# Altium project cheese_cave.PrjPcb
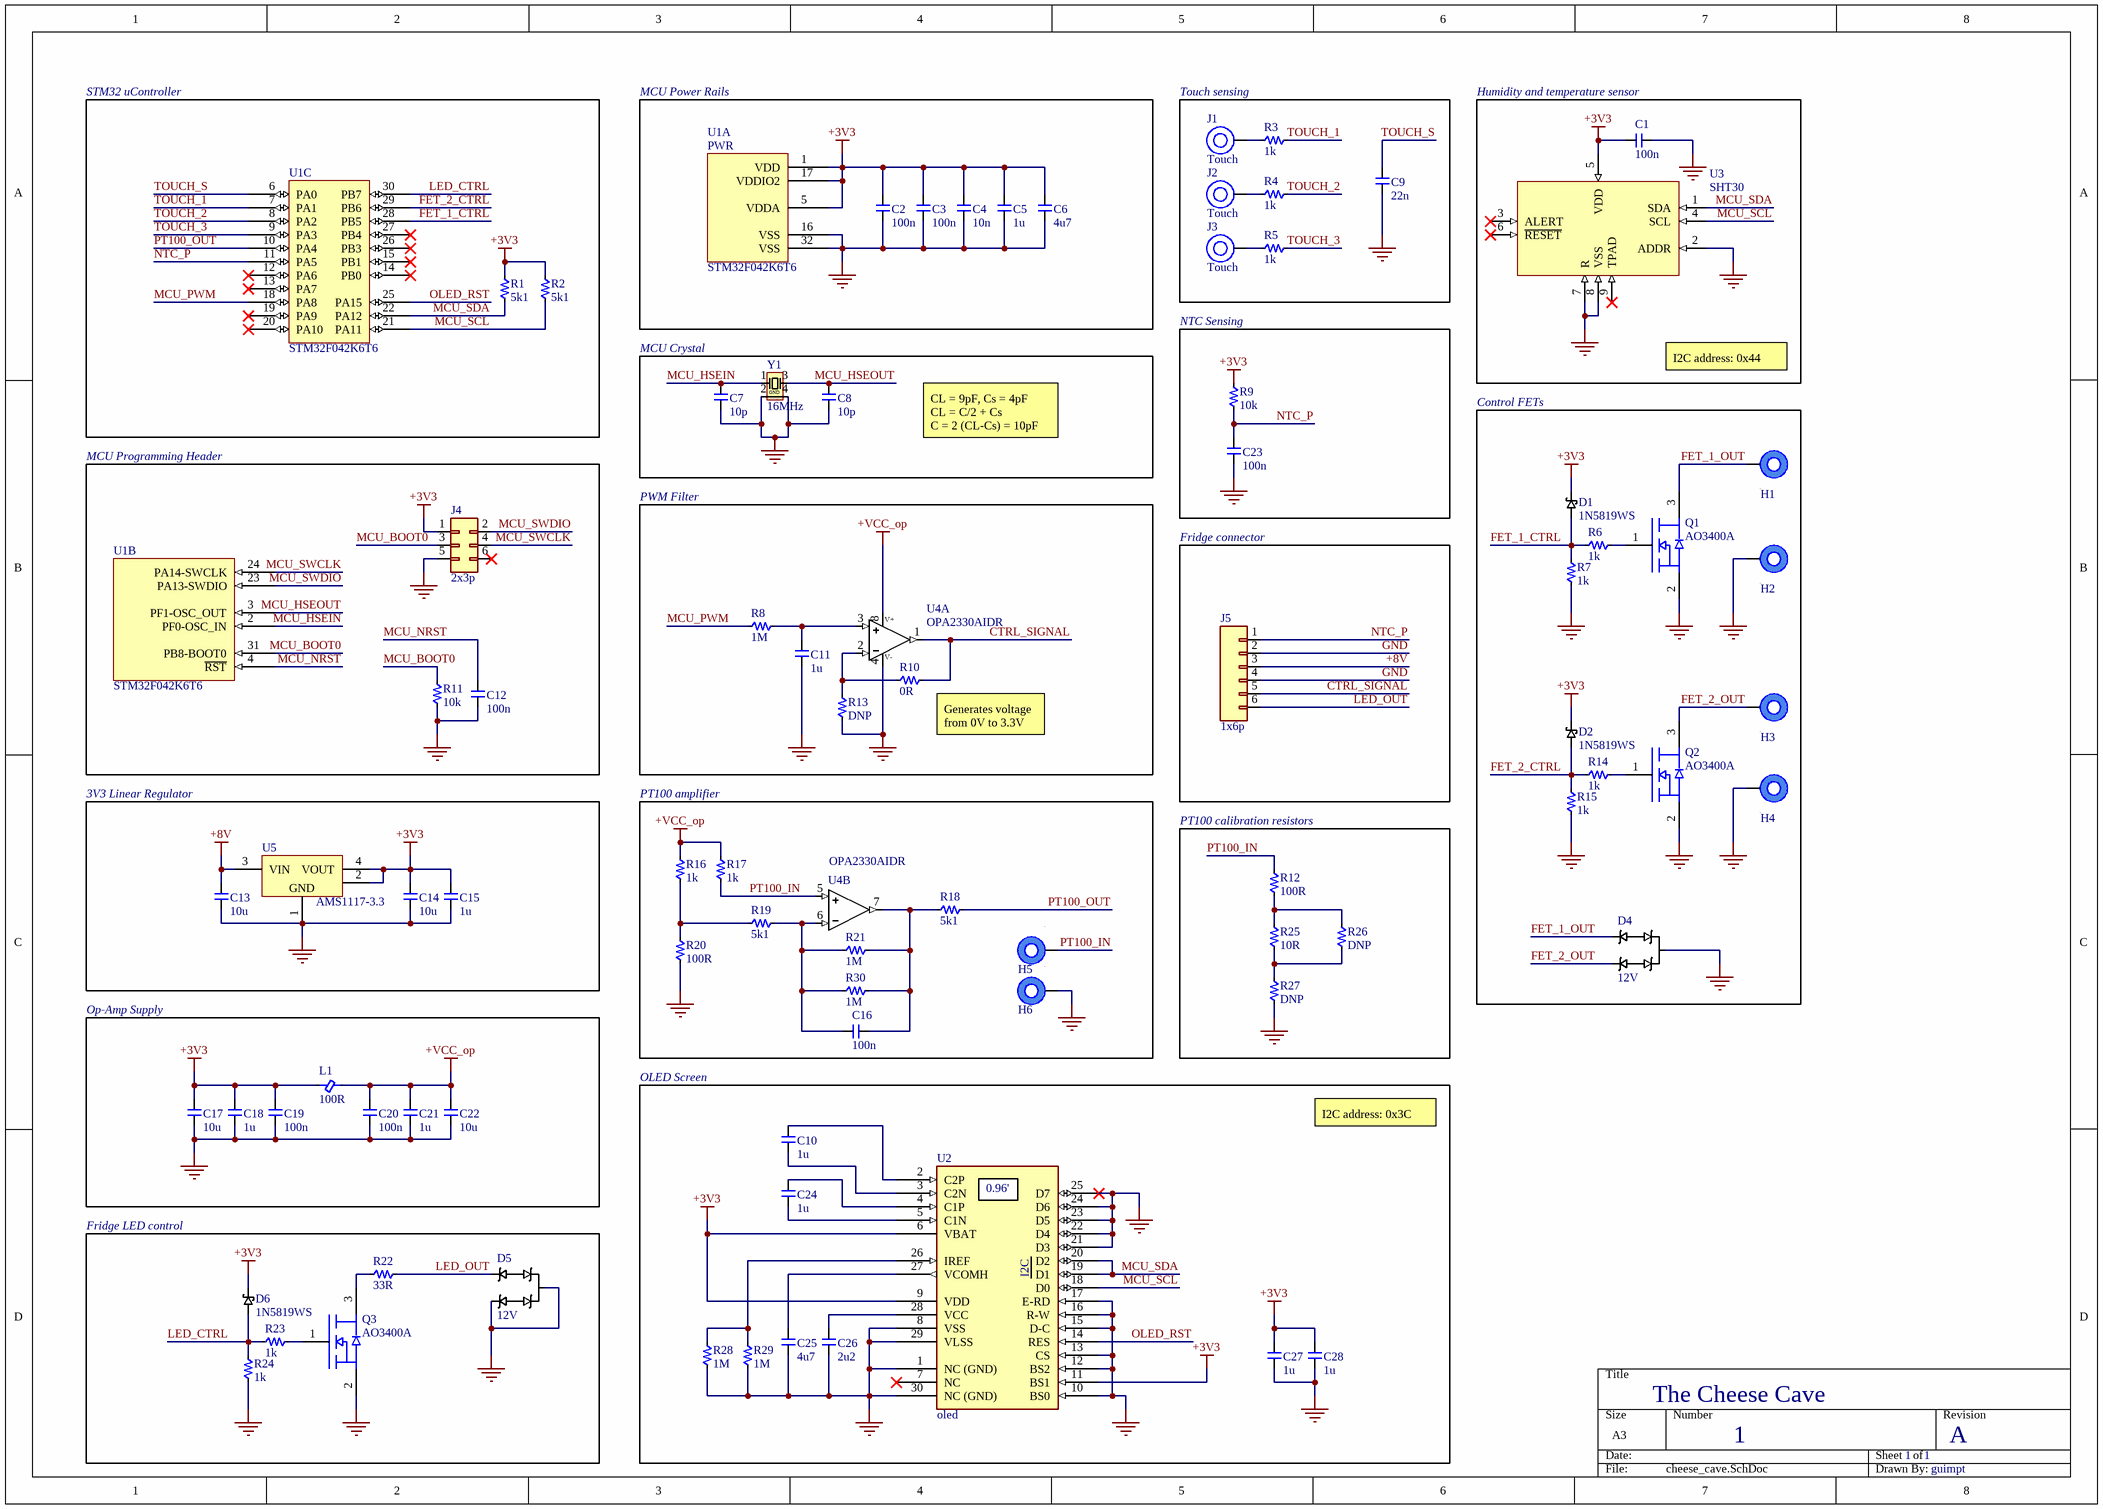
[diagram p0: cheese_cave.SchDoc]
1 sheet, 84 parts. Net scope: global (net labels, ports and power ports of the same name join across sheets).
Board file: cheese_cave.PcbDoc

## Sheet cheese_cave.SchDoc
size A3; SheetNumber: 1; SheetTotal: 1

### Parts
C1  100n  [C0402]
C2  100n  [C0402]
C3  100n  [C0402]
C4  10n  [C0402]
C5  1u  [C0805]
C6  4u7  [C0805]
C7  10p  [C0402]
C8  10p  [C0402]
C9  22n  [C0402]
C10  1u  [C0805]
C11  1u  [C0805]
C12  100n  [C0402]
C13  10u  [C0805]
C14  10u  [C0805]
C15  1u  [C0805]
C16  100n  [C0402]
C17  10u  [C0805]
C18  1u  [C0805]
C19  100n  [C0402]
C20  100n  [C0402]
C21  1u  [C0805]
C22  10u  [C0805]
C23  100n  [C0402]
C24  1u  [C0805]
C25  4u7  [C0805]
C26  2u2  [C0805]
C27  1u  [C0805]
C28  1u  [C0805]
D1  1N5819WS  [SOD323]
D2  1N5819WS  [SOD323]
D4  12V  [SOT23_protek]
D5  12V  [SOT23_protek]
D6  1N5819WS  [SOD323]
H1  1x1  [1x1p]  (value not drawn)  (no BOM)
H2  1x1  [1x1p]  (value not drawn)  (no BOM)
H3  1x1  [1x1p]  (value not drawn)  (no BOM)
H4  1x1  [1x1p]  (value not drawn)  (no BOM)
H5  1x1  [1x1p]  (value not drawn)  (no BOM)
H6  1x1  [1x1p]  (value not drawn)  (no BOM)
J1  Touch  [F10-10-6.5-0.4 Z]  (no BOM)
J2  Touch  [F10-10-6.5-0.4 Z]  (no BOM)
J3  Touch  [F10-10-6.5-0.4 Z]  (no BOM)
J4  2x3p  [2x3p_conn]
J5  1x6p  [1X6P_CONN]
L1  100R  [L0805]
Q1  AO3400A  [SOT23_alphaomega]
Q2  AO3400A  [SOT23_alphaomega]
Q3  AO3400A  [SOT23_alphaomega]
R1  5k1  [R0402]
R2  5k1  [R0402]
R3  1k  [R0402]
R4  1k  [R0402]
R5  1k  [R0402]
R6  1k  [R0402]
R7  1k  [R0402]
R8  1M  [R0402]
R9  10k  [R0402]
R10  0R  [R0402]
R11  10k  [R0402]
R12  100R  [R0402]
R13  DNP  [R0402]
R14  1k  [R0402]
R15  1k  [R0402]
R16  1k  [R0402]
R17  1k  [R0402]
R18  5k1  [R0402]
R19  5k1  [R0402]
R20  100R  [R0402]
R21  1M  [R0402]
R22  33R  [R0402]
R23  1k  [R0402]
R24  1k  [R0402]
R25  10R  [R0402]
R26  DNP  [R0402]
R27  DNP  [R0402]
R28  1M  [R0402]
R29  1M  [R0402]
R30  1M  [R0402]
U1  STM32F042K6T6  [LQFP32-ST]  (parts A,B,C of 3)
U2  oled  [OLED_096_SSD1306]
U3  SHT30  [SHT30-DIS-B2.5KS]
U4  OPA2330AIDR  [SOIC8]  (parts A,B of 2)
U5  AMS1117-3.3  [SOT223]
Y1  16MHz  [SMD3225-4P]

### Blocks framed on the sheet
STM32 uController: R1 R2 U1
MCU Power Rails: C2-C6 U1
Touch sensing: C9 J1-J3 R3-R5
Humidity and temperature sensor: C1 U3
NTC Sensing: C23 R9
MCU Crystal: C7 C8 Y1
Control FETs: D1 D2 D4 H1-H4 Q1 Q2 R6 R7 R14 R15
MCU Programming Header: C12 J4 R11 U1
PWM Filter: C11 R8 R10 R13 U4
Fridge connector: J5
3V3 Linear Regulator: C13-C15 U5
PT100 amplifier: C16 H5 H6 R16-R21 R30 U4
PT100 calibration resistors: R12 R25-R27
Op-Amp Supply: C17-C22 L1
OLED Screen: C10 C24-C28 R28 R29 U2
Fridge LED control: D5 D6 Q3 R22-R24

### Nets
+3V3: C1.1 C2.2 C3.2 C4.2 C5.2 C6.2 C14.2 C15.2 C17.2 C18.2 C19.2 C27.1 C28.1 D1.2 D2.2 D6.2 J4.1 L1.1 R1.1 R2.1 R9.2 U1.1(VDD) U1.5(VDDA) U1.17(VDDIO2) U2.6(VBAT) U2.9(VDD) U2.11(BS1) U3.5(VDD) U5.2(VOUT) U5.4(VOUT)
+8V: C13.2 J5.3 U5.3(VIN)
+VCC_op: C20.2 C21.2 C22.2 L1.2 R16.2 R17.2 U4.8(V+)
GND: C1.2 C2.1 C3.1 C4.1 C5.1 C6.1 C7.1 C8.1 C9.1 C11.1 C12.1 C13.1 C14.1 C15.1 C17.1 C18.1 C19.1 C20.1 C21.1 C22.1 C23.1 C25.2 C26.2 C27.2 C28.2 D4.3 D5.2 D5.3 H2.1 H4.1 H6.1 J4.5 J5.2 J5.4 Q1.2 Q2.2 Q3.2 R7.1 R11.1 R13.1 R15.1 R20.1 R24.1 R27.1 R28.1 R29.1 U1.16(VSS) U1.32(VSS) U2.1(NC_(GND)) U2.8(VSS) U2.10(BS0) U2.12(BS2) U2.13(CS) U2.15(D-C) U2.16(R-W) U2.17(E-RD) U2.21(D3) U2.22(D4) U2.23(D5) U2.24(D6) U2.25(D7) U2.29(VLSS) U2.30(NC_(GND)) U3.2(ADDR) U3.7(R) U3.8(VSS) U4.4(V-) U5.1(GND) Y1.2 Y1.4
CTRL_SIGNAL: J5.5 R10.2 U4.1(outA)
FET_1_CTRL: D1.1 R6.2 R7.2 U1.28(PB5)
FET_1_OUT: D4.1 H1.1 Q1.3
FET_2_CTRL: D2.1 R14.2 R15.2 U1.29(PB6)
FET_2_OUT: D4.2 H3.1 Q2.3
LED_CTRL: D6.1 R23.2 R24.2 U1.30(PB7)
LED_OUT: D5.1 J5.6 R22.2
MCU_BOOT0: J4.3 R11.2 U1.31(PB8-BOOT0)
MCU_HSEIN: C7.2 U1.2(PF0-OSC_IN) Y1.1
MCU_HSEOUT: C8.2 U1.3(PF1-OSC_OUT) Y1.3
MCU_NRST: C12.2 U1.4(~{RST})
MCU_PWM: R8.2 U1.18(PA8)
MCU_SCL: R2.2 U1.21(PA11) U2.18(D0) U3.4(SCL)
MCU_SDA: R1.2 U1.22(PA12) U2.19(D1) U2.20(D2) U3.1(SDA)
MCU_SWCLK: J4.4 U1.24(PA14-SWCLK)
MCU_SWDIO: J4.2 U1.23(PA13-SWDIO)
NTC_P: C23.2 J5.1 R9.1 U1.11(PA5)
OLED_RST: U1.25(PA15) U2.14(RES)
PT100_IN: H5.1 R12.2 R17.1 U4.5(INB+)
PT100_OUT: R18.2 U1.10(PA4)
TOUCH_1: R3.1 U1.7(PA1)
TOUCH_2: R4.1 U1.8(PA2)
TOUCH_3: R5.1 U1.9(PA3)
TOUCH_S: C9.2 U1.6(PA0)
NetC10_1: C10.1 U2.3(C2N)
NetC10_2: C10.2 U2.2(C2P)
NetC11_2: C11.2 R8.1 U4.3(INA+)
NetC16_1: C16.1 R18.1 R21.2 R30.2 U4.7(outB)
NetC16_2: C16.2 R19.2 R21.1 R30.1 U4.6(INB-)
NetC24_1: C24.1 U2.4(C1P)
NetC24_2: C24.2 U2.5(C1N)
NetC25_1: C25.1 U2.27(VCOMH)
NetC26_1: C26.1 U2.28(VCC)
NetJ1_1: J1.1 R3.2
NetJ2_1: J2.1 R4.2
NetJ3_1: J3.1 R5.2
NetQ1_1: Q1.1 R6.1
NetQ2_1: Q2.1 R14.1
NetQ3_1: Q3.1 R23.1
NetQ3_3: Q3.3 R22.1
NetR10_1: R10.1 R13.2 U4.2(INA-)
NetR12_1: R12.1 R25.2 R26.2
NetR16_1: R16.1 R19.1 R20.2
NetR25_1: R25.1 R26.1 R27.2
NetR28_2: R28.2 R29.2 U2.26(IREF)

Not connected (* = marked no-connect by the designer): J4 6*; U1 12(PA6)* 13(PA7)* 14(PB0)* 15(PB1)* 19(PA9)* 20(PA10)* 26(PB3)* 27(PB4)*; U2 7(NC)*; U3 3(ALERT)* 6(~{RESET})* 9(TPAD)*

### Notes on the sheet
- I2C address: 0x44
- CL = 9pF, Cs = 4pF
  CL = C/2 + Cs
  C = 2 (CL-Cs) = 10pF
- (near R10) Generates voltage from 0V to 3.3V
- I2C address: 0x3C
- The Cheese Cave
- 1
- A
- guimpt
- (in symbol OLED_096_SSD1306) 0.96'; I2C
- (in symbol STM32F042K6T6, part A) PWR
- (in symbol X322516MLB4SI) GND

### Library data of the parts
C1-C4 C7-C9 C12 C16 C19 C20 C23 = C_0402: 0402 cap
  C1-C3 C12 C16 C19 C20 C23: LCSC: C1525
  C4: LCSC: C15195
  C7 C8: LCSC: C32949
  C9: LCSC: C1532
C5 C6 C10 C11 C13-C15 C17 C18 C21 C22 C24-C28 = C_0805: 0805 cap
  C5 C10 C11 C15 C18 C21 C24 C27 C28: LCSC: C28323
  C6 C25: LCSC: C1779
  C13 C14 C17 C22: LCSC: C15850
  C26: LCSC: C377773
D1 D2 D6 = 1N5819WS: 40V 600mV@1A 1A SOD-323  Schottky; LCSC: C191023
D4 D5 = PSM712-LF-T7: 19V 13.3V 12V SOT-23(TO-236)  TVS; LCSC: C32677
H1-H6 = 1x1p: 0.85mm hole
J1-J3 = F10-10-6.5-0.4Z
J4 = 2x3p_conn: 2x3 male pin header; LCSC: C124390
J5 = 1x6p_conn: 1x6 male pin header; LCSC: C7501293
L1 = GZ2012D101TF: ±25% 100Ω@100MHz 0805  150mR Ferrite Beads; LCSC: C1015
Q1-Q3 = AO3400A: 30V 5.7A 26.5mΩ@10V,5.7A 1.4W N Channel SOT-23-3L  MOSFET; LCSC: C20917
R1-R30 = R_0402: 0402 62.5mW
  R1 R2 R18 R19: LCSC: C25905
  R3-R7 R14-R17 R23 R24: LCSC: C11702
  R8 R21 R28-R30: LCSC: C26083
  R9 R11: LCSC: C25744
  R10: LCSC: C17168
  R12 R20: LCSC: C25076
  R22: LCSC: C25105
  R25: LCSC: C25077
U1 = STM32F042K6T6: RISC Microcontroller, 32-Bit, FLASH, CORTEX-M0 CPU, 48MHz, CMOS, PQFP32; Manufacturer: STMicroelectronics; Package Body Material: Plastic; Clock Frequency: 32MHz; Number of I/O Lines: 26; Speed: 48RPM; Max Supply Voltage: 3.6V; Min Supply Voltage: 2V; Nominal Supply Voltage: 3.3V; Package Equivalence Code: QFP32,.35SQ,32; Power Supplies: 2.5/3.3V; Max Supply Current: 23.4mA; Qualification Status: Not Qualified; Supplier: Mouser; Supplier Part Number: 511-STM32F042K6T6; Manufacturer Part Number: STM32F042K6T6; RoHS: Yes; Category: Microcontrollers; Stock: 3030; Pricing: 1=3.82, 10=3.43, 50=3.43, 100=2.81, 1000=2.02, 10000=1.98 (USD); Case/Package: LQFP; Pins: 32; Package Shape: Square; Min Operating Temperature: -40°C; Max Operating Temperature: 85°C; JESD-30 Code: S-PQFP-G32; Package Style: FLATPACK, LOW PROFILEMeter; Surface Mount: Yes; Technology: CMOS; Terminal Form: Gull Wing; Terminal Position: QUAD; Length: 7mm; Width: 7mm; Height - Seated (Max): 1.6mm; Terminal Pitch: 0.8mm; Temperature Grade: INDUSTRIAL; Reach SVHC Compliant: Yes; RoHS Compliant: Yes; ComponentLink1URL: https://datasheet.ciiva.com:443/pdfs/VipMasterIC/IC/SGST/SGST-S-A0002862944/SGST-S-A0002862944-1.pdf?src-supplier=IHS+Markit; ComponentLink1Description: https://datasheet.ciiva.com:443/pdfs/VipMasterIC/IC/SGST/SGST-S-A0002862944/SGST-S-A0002862944-1.pdf?src-supplier=IHS+Markit; ComponentLink2URL: https://datasheet.ciiva.com/48492/dm00105814-48492533.pdf?src-supplier=Avnet; ComponentLink2Description: https://datasheet.ciiva.com/48492/dm00105814-48492533.pdf?src-supplier=Avnet; LCSC: C69216
U2 = OLED_096_SSD1306: 0.96 inch frameless SSD1306 oled; LCSC: C2890596
U3 = SHT30-DIS-B2.5KS: Temperature and Humidity Sensor; LCSC: C77361
U4 = OPA2330AIDR: Precision opamp; LCSC: C128746
U5 = AMS1117-3.3: 72dB@(120Hz) 1A 1.3V@(800mA) Fixed 3.3V~3.3V Positive 1 SOT-223; LCSC: C6186
Y1 = X322516MLB4SI: 16MHz SMD Crystal Resonator 9pF ±10ppm ±30ppm -40℃~+85℃ SMD3225-4P Crystals ROHS; LCSC: C13738

## Assembly variants
BASIC: not fitted R13 R26 R27